# Altium project half-bridge-smps.PrjPcb
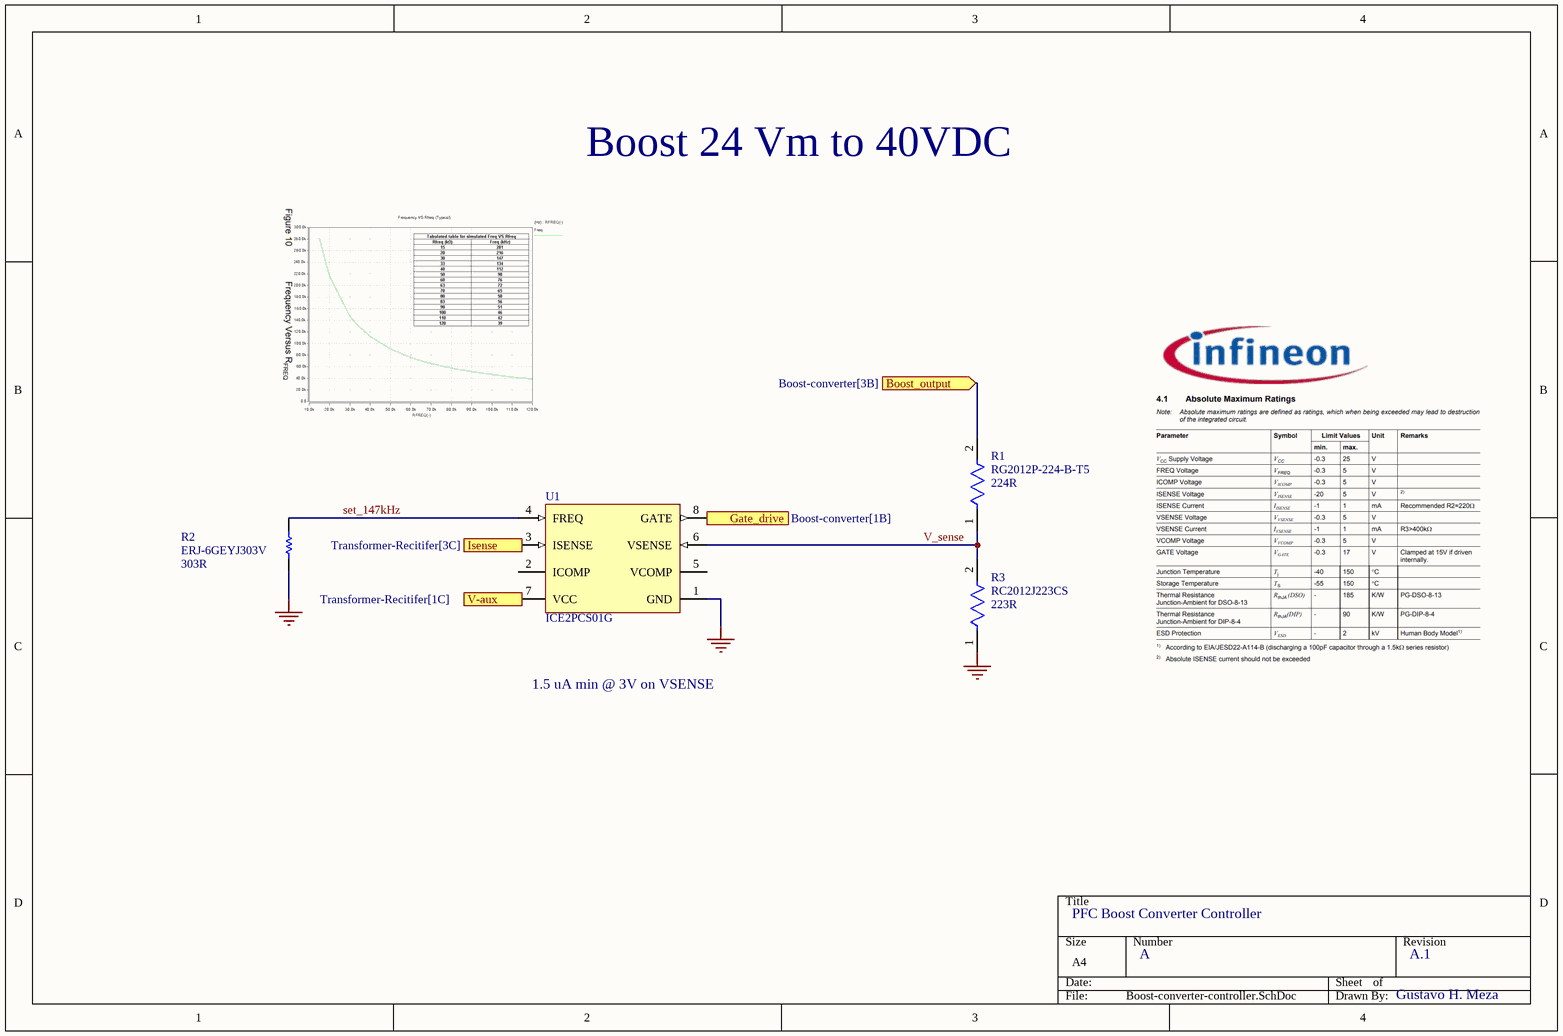
[diagram p0: Boost-converter-controller.SchDoc]
6 sheets, 44 parts. Net scope: flat (ports and power ports of the same name join across sheets).
Sheets:
  Boost-converter-controller.SchDoc
  Transformer-Recitifer.SchDoc
  Boost-converter.SchDoc
  Line-filter.SchDoc
  Buck-converter-controller.SchDoc
  Sheet1.SchDoc

## Sheet Boost-converter-controller.SchDoc
size A4; SheetNumber: 1; SheetTotal: 6

### Parts
R1  RG2012P-224-B-T5  Resistance: 224R  [FP-RG2012-IPC_A]
R2  ERJ-6GEYJ303V  Resistance: 303R  [RESC2013X70X40NL20T20]
R3  RC2012J223CS  Resistance: 223R  [FP-RC2012-IPC_A]
U1  ICE2PCS01G  [INF-PG-DSO-8-16_N]

### Ports
Boost_output (in, see Boost-converter[3B]), Gate_drive (out, see Boost-converter[1B]), Isense (in, see Transformer-Recitifer[3C]), V-aux (in, see Transformer-Recitifer[1C])

### Nets
GND: R2.1 R3.1 U1.1(GND)  [project net DTC]
set_147kHz: R2.2 U1.4(FREQ)
V_sense: R1.1 R3.2 U1.6(VSENSE)
NetC5_2: R1.2 ; port Boost_output
NetR7_1: U1.8(GATE) ; port Gate_drive

Not connected (* = marked no-connect by the designer): U1 2(ICOMP) 3(ISENSE) 5(VCOMP) 7(VCC)

### Notes on the sheet
- Boost 24 Vm to 40VDC
- 1.5 uA min @ 3V on VSENSE
- PFC Boost Converter Controller
- A
- A.1
- Gustavo H. Meza

### Library data of the parts
R1 = CMP-2001-02850-2: Automotive Metal Thin Film Chip Resistor, 0805, 220kΩ, 0.1%, 25ppm/°C, 0.125W, 150V; Voltage Rating: 100V; Power Rating: 100mW; Max Power Dissipation: 125mW; Voltage Rating (DC): 150V; Length: 0.079inch; RoHS Compliant: Yes; Series: RG; Termination: SMD/SMT; Case Code (Metric): 2012; Resistor Type: Thin Film; Lead Free: Lead Free; Number of Terminations: 2; Width: 0.049inch; Features: Automotive AEC-Q200; Case Code (Imperial): 0805; Packaging: Tape and Reel; Min Operating Temperature: -55°C; Max Operating Temperature: 155°C; Case/Package: 0805; Tolerance: 0.1%; Temperature Coefficient: 25ppm/°C; Package Quantity: 1; Height: 0.02inch
R2 = CMP-2001-00396-1: Manufacturer: Panasonic; Part Number: ERJ-6GEYJ303V
R3 = CMP-13261-000383-1: Res Thick Film 0805 22kΩ 5% 0.125W ±100ppm/°C Molded SMD T/R; Voltage Rating (DC): 150V; Max Power Dissipation: 125mW; Packaging: Tape and Reel; Height: 0.024inch; Case/Package: 0805; Tolerance: 5%; Contact Plating: Tin; Package Quantity: 1; Max Operating Temperature: 155°C; Length: 2mm; Military Standard: Not; Min Operating Temperature: -55°C; Temperature Coefficient: 100ppm/°C; Width: 0.049inch; Case Code (Metric): 2012; Depth: 1.25mm; Number of Terminations: 2; Case Code (Imperial): 0805; Radiation Hardening: No; Composition: Thick Film; Lead Free: Lead Free; Features: Moisture Resistant
U1 = CMP-1105-00012-1: Standalone Power Factor Correction (PFC) Controller in Continuous Conduction Mode (CCM), 11 to 26 V, -1.5 A / 2 A Iq, -40 to 125 degC, PG-DSO-8-16, Reel, Green; Manufacturer: Infineon; Output: MOSFET Gate Driver; IQ (max): -1.5Â A / 2 A; Green: TRUE; VCC (max): 26Â V; Group: DSO-8; ICC (max): 20Â mA; Iq (typ): 300Â uA; VCC (min): 11Â V; Frequency ( f ) Range: 50kHz - 250kHz; PackageDescription: 8-Pin Plastic (Green) Dual Small Outline Package, 4.9 x 3.9 mm Body, 1.27 mm Pitch; Mounting Technology: Surface Mount; PackageReference: PG-DSO-8-16; PackageVersion: Mar-07; ComponentLink3Description: Package Specification; ComponentLink3URL: http://www.infineon.com/dgdl/TLE7259-2GE_DS_rev12.pdf?folderId=db3a3043163797a6011666d32a0c0de1&fileId=db3a3043163797a6011666d4dbb80de2&location=en.Products.Automotive_ICs.Automotive_Transceivers.LIN_Transceivers.DATASHEET.TLE7259-2GE_DS_rev12.pdf; Halogen-free: TRUE; ComponentLink1URL: http://www.infineon.com/; ComponentLink1Description: Manufacturer URL; PartNumber: ICE2PCS01G; ComponentLink2URL: http://www.infineon.com/dgdl/ProductDatasheetICE2PCS01_v2_3+Mar+2010.pdf?folderId=db3a304412b407950112b4182a3d24f8&fileId=db3a304412b407950112b427caa43ccf; ComponentLink2Description: Datasheet; DatasheetVersion: Rev. 2.3

## Sheet Transformer-Recitifer.SchDoc
size A4; SheetNumber: 2; SheetTotal: 6
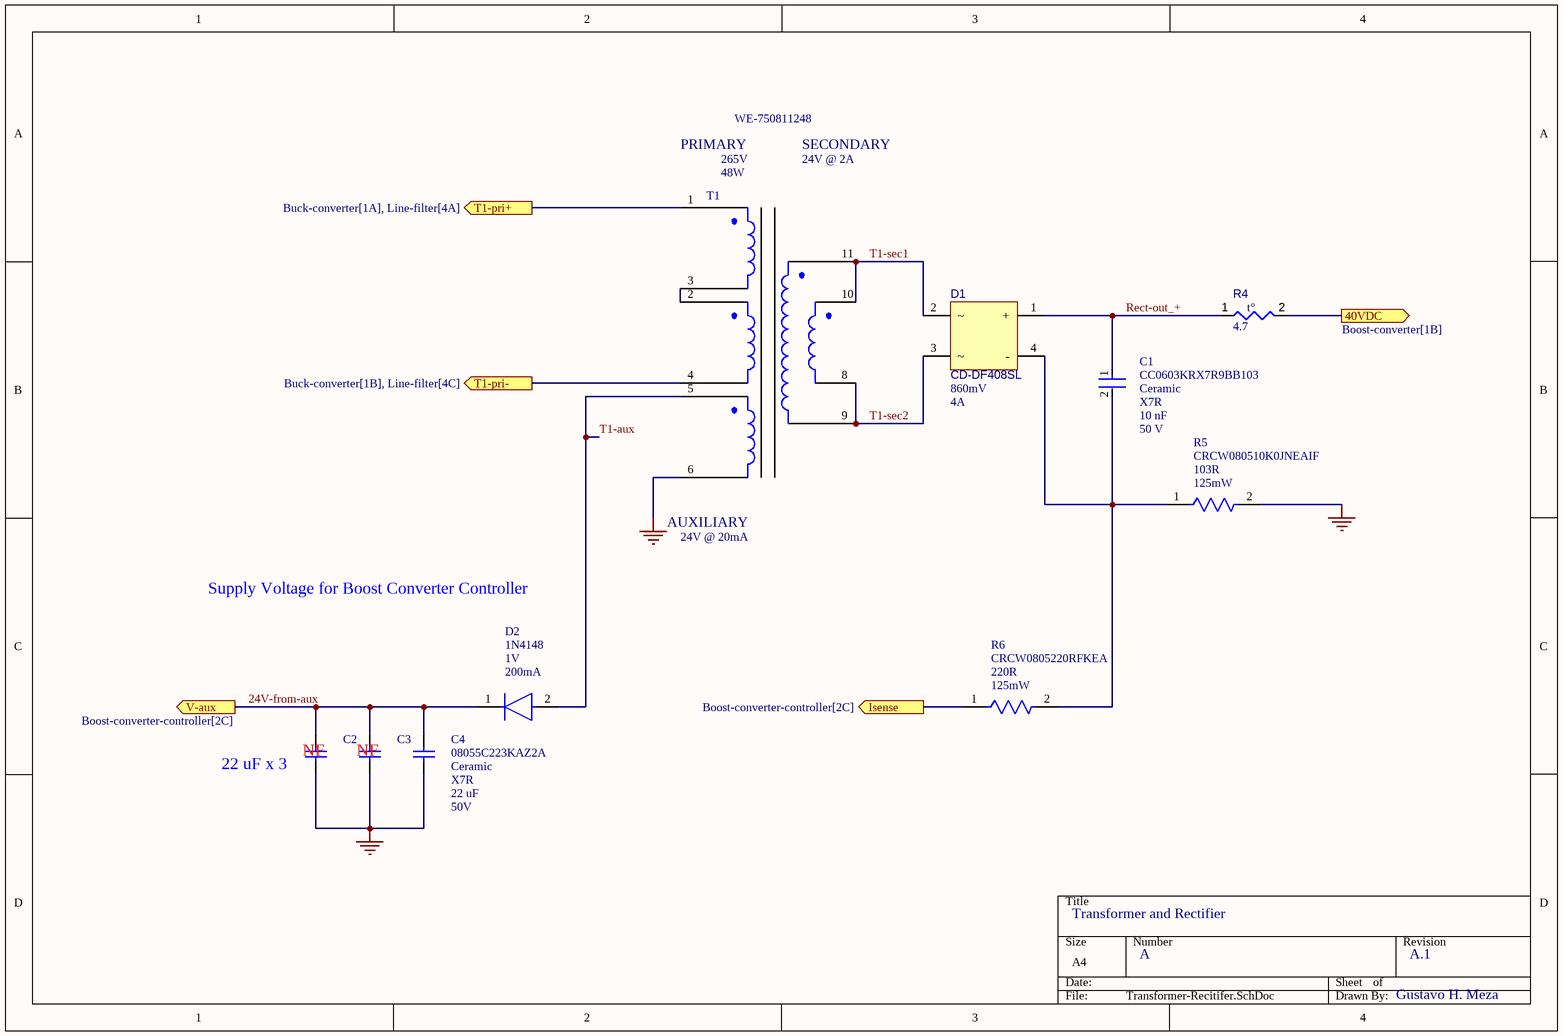
[diagram p1: Transformer-Recitifer.SchDoc]

### Parts
C1  CC0603KRX7R9BB103  Temperature Characteristic: X7R  Voltage Rating: 50 V  Material: Ceramic  Capacitance: 10 nF  [FP-CC0603-DA-MFG]
C2  08055C223KAZ2A  [CAPC2013X94X50ML20T25]  (value not drawn)
C3  08055C223KAZ2A  [CAPC2013X94X50ML20T25]  (value not drawn)
C4  08055C223KAZ2A  Capacitance: 22 uF  Voltage rating: 50V  Dieleectric: X7R  Material: Ceramic  [CAPC2013X94X50ML20T25]
D1  CD-DF408SL  Forward Voltage: 860mV  Forward Current: 4A  [CD-DF408SL-Footprint-1]
D2  1N4148  Forward Voltage: 1V  Output Current: 200mA  [FP-017AG-MFG]
R4  value 4.7  [B57236S0479M000-Footprint-1]  (hidden comment: B57236S0479M000)
R5  CRCW080510K0JNEAIF  Max Power Dissipation: 125mW  Resistance: 103R  [FP-CRCW0805-e3-MFG]
R6  CRCW0805220RFKEA  Max Power Dissipation: 125mW  Resistance: 220R  [FP-CRCW0805-e3-MFG]
T1  WE-750811248  Power: 48W  Voltage Rating: 265V  Auxiliary winding voltage: 24V @ 20mA  Secondary winding voltage: 24V @ 2A  [WE-750811248-Footprint-1]

### Ports
40VDC (out, see Boost-converter[1B]), Isense (out, see Boost-converter-controller[2C]), T1-pri+ (out, see Buck-converter[1A], Line-filter[4A]), T1-pri- (out, see Buck-converter[1B], Line-filter[4C]), V-aux (out, see Boost-converter-controller[2C])

### Nets
GND: C2.1 C3.1 C4.1 R5.2 T1.6  [project net DTC]
24V-from-aux: C2.2 C3.2 C4.2 D2.1(C) ; port V-aux
Rect-out_+: C1.1 D1.1(+) R4.1
T1-aux: D2.2(A) T1.5
T1-sec1: D1.2 T1.10 T1.11
T1-sec2: D1.3 T1.8 T1.9
NetC1_2: C1.2 D1.4(-) R5.1 R6.2
NetL1_1: R4.2 ; port 40VDC
NetL2_3: T1.4 ; port T1-pri-
NetL2_4: T1.1 ; port T1-pri+
NetR6_1: R6.1 ; port Isense
NetT1_2: T1.2 T1.3

### Notes on the sheet
- PRIMARY
- SECONDARY
- (near T1) AUXILIARY
- Supply Voltage for Boost Converter Controller
- (near C2) 22 uF x 3
- (near C2) NF
- (near C3) NF
- Transformer and Rectifier
- A
- A.1
- Gustavo H. Meza
- (in symbol CMP-009-00189-1) t°

### Library data of the parts
C1 = CMP-2100-03600-2: CAP CER 10000PF 50V X7R 0603; Manufacturer: YAGEO; Tolerance: 0.1; Temperature Coefficient: 15%; Value: 10 nF; Mouser Description: Multilayer Ceramic Capacitor, CC Series, 0.01 - F, - 10%, X7R, 50 V, 0603 [1608 Metric]; Digikey Description: CAP CER 10000PF 50V X7R 0603; Height: 0.9mm; Category: Cap; Footprint Url: http://www.yageo.com/exep/pages/download/literatures/UPY-C_GEN_24.pdf; Lead Free: Yes; Manufacturer Part Number: CC0603KRX7R9BB103; Temperature: -55°C to +125°C; Device Class L3: Ceramic Capacitors; ComponentLink2Description: Datasheet; Voltage: 50 V; Package: CC0603-DA; Octopart: https://octopart.com/cc0603krx7r9bb103-yageo-192938; Automotive: No; Temperature Range High: +125°C; Temperature Range Low: -55°C; RoHS: TRUE; Device Class L1: Passive Components; ComponentLink2URL: http://www.yageo.com/documents/recent/UPY-GPHC_X7R_6.3V-to-50V_18.pdf; Device Class L2: Capacitors
C2-C4 = CMP-2007-04398-1: Manufacturer: AVX Interconnect / Elco; Part Number: 08055C223KAZ2A
D1 = CMP-004-00034-1: Bridge Rectifier Diode, 1 Phase, 4A, 800V V(RRM), Silicon; Max Surge Current: 150A; Reach SVHC Compliant: No; Min Operating Temperature: -55°C; Max Operating Temperature: 175°C; RoHS Compliant: Yes; Mounting Technology: Flat; JESD-609 Code: e3; Diode Type: RECTIFIER
D2 = CMP-07163-000046-1: DIODE GEN PURP 100V 200MA DO35; Max Power Dissipation: 500mW; Max Reverse Current: 5uA; Forward Current: 300mA; Current: 4A; Reverse Recovery Time: 4ns; Element Configuration: Single; Outside Diameter: 1.85mm; Capacitance: 4pF; Polarity: Standard; Max Forward Surge Current (Ifsm): 1A; Reverse Voltage: 100V; Average Rectified Current: 200mA; Diameter: 1.91mm; Max Repetitive Reverse Voltage (Vrrm): 100V; Current Rating: 200mA; Case/Package: DO-35; Lead Free: Lead Free; Number of Pins: 2; Recovery Time: 4ns; Packaging: Bulk; Contact Plating: Tin; Voltage: 100V; Mount: Through Hole; Max Surge Current: 4A; Package Quantity: 2000; Width: 1.91mm; Max Reverse Voltage (DC): 100V; Length: 4.56mm; Radiation Hardening: No; Power Dissipation: 500mW; Voltage Rating (DC): 100V; Peak Non-Repetitive Surge Current: 4A; REACH SVHC: No SVHC; Height: 4.56mm; Max Operating Temperature: 175°C; Series: -; Weight: 0.01lb; Min Operating Temperature: -65°C
R4 = CMP-009-00189-1: NTC Thermistor, 4.7ohm, Through Hole Mount; Tolerance: 20%; Power: 2.1W; Mounting Technology: Through Hole; Max Operating Temperature: 170°C; Min Operating Temperature: -55°C; JESD-609 Code: e3; Manufacturer Series: B57236S0479M000; RoHS Compliant: Yes; Pins: 2
R5 = CMP-00030-42634559-1: CRCW080510K0JNEAIF Res Thick Film 0805 10K Ohm 5% 0.125W(1/8W) ±200ppm/°C Pad SMD Automotive T/R; Manufacturer Package Identifier: CRCW0805-e3; Voltage Rating: 150V; Depth: 1.25mm; Case Code (Metric): 2012; Case/Package: 0805; Military Standard: Not; NexarPartId: 42634559; Case Code (Imperial): 0805; Termination: Solder; Width: 1.2446mm; REACH SVHC: Unknown; Min Operating Temperature: -55°C; Length: 2mm; Packaging: Tape & Reel (TR); Lead Free: Lead Free; Number of Pins: 2; Power Rating: 125mW; Composition: Thick Film; RoHS: Compliant; Temperature Coefficient: 200ppm/°C; Features: Automotive AEC-Q200; Voltage Rating (DC): 150V; Height: 508µm; Tolerance: 5%; Schedule B: 8533210045, 8533210045; Max Operating Temperature: 155°C; Number of Terminations: 2
R6 = CMP-2001-03682-2: RES Thick Film, 220Ω, 1%, 0.125W, 100ppm/°C, 0805; Voltage Rating: 150V; Packaging: Tape and Reel; Termination: SMD/SMT; Height: 0.45mm; Package Quantity: 10; Width: 0.049inch; Min Operating Temperature: -55°C; Lead Free: Lead Free; Military Standard: Not; Mount: Surface Mount; Max Operating Temperature: 155°C; Voltage Rating (DC): 150V; Composition: Thick Film; Case/Package: 0805; Length: 2mm; Weight: 0.000194oz; Case Code (Metric): 2012; Number of Terminations: 2; Case Code (Imperial): 0805; Radiation Hardening: No; Tolerance: 1%; Features: Automotive AEC-Q200; Power Rating: 125mW; Depth: 1.25mm; Contact Plating: Tin; Temperature Coefficient: 100ppm/°C
T1 = CMP-012-00000-1: Power Transformers MID-L3798/99 Offline Isol 3.6uH +-10%; Inductance: 300uH; Turns Ratio: 0.167372; Min Operating Temperature: -40°C; Mounting Technology: THT; Max Operating Temperature: 125°C; Pins: 10; RoHS Compliant: Yes

## Sheet Boost-converter.SchDoc
size A4; SheetNumber: 3; SheetTotal: 6
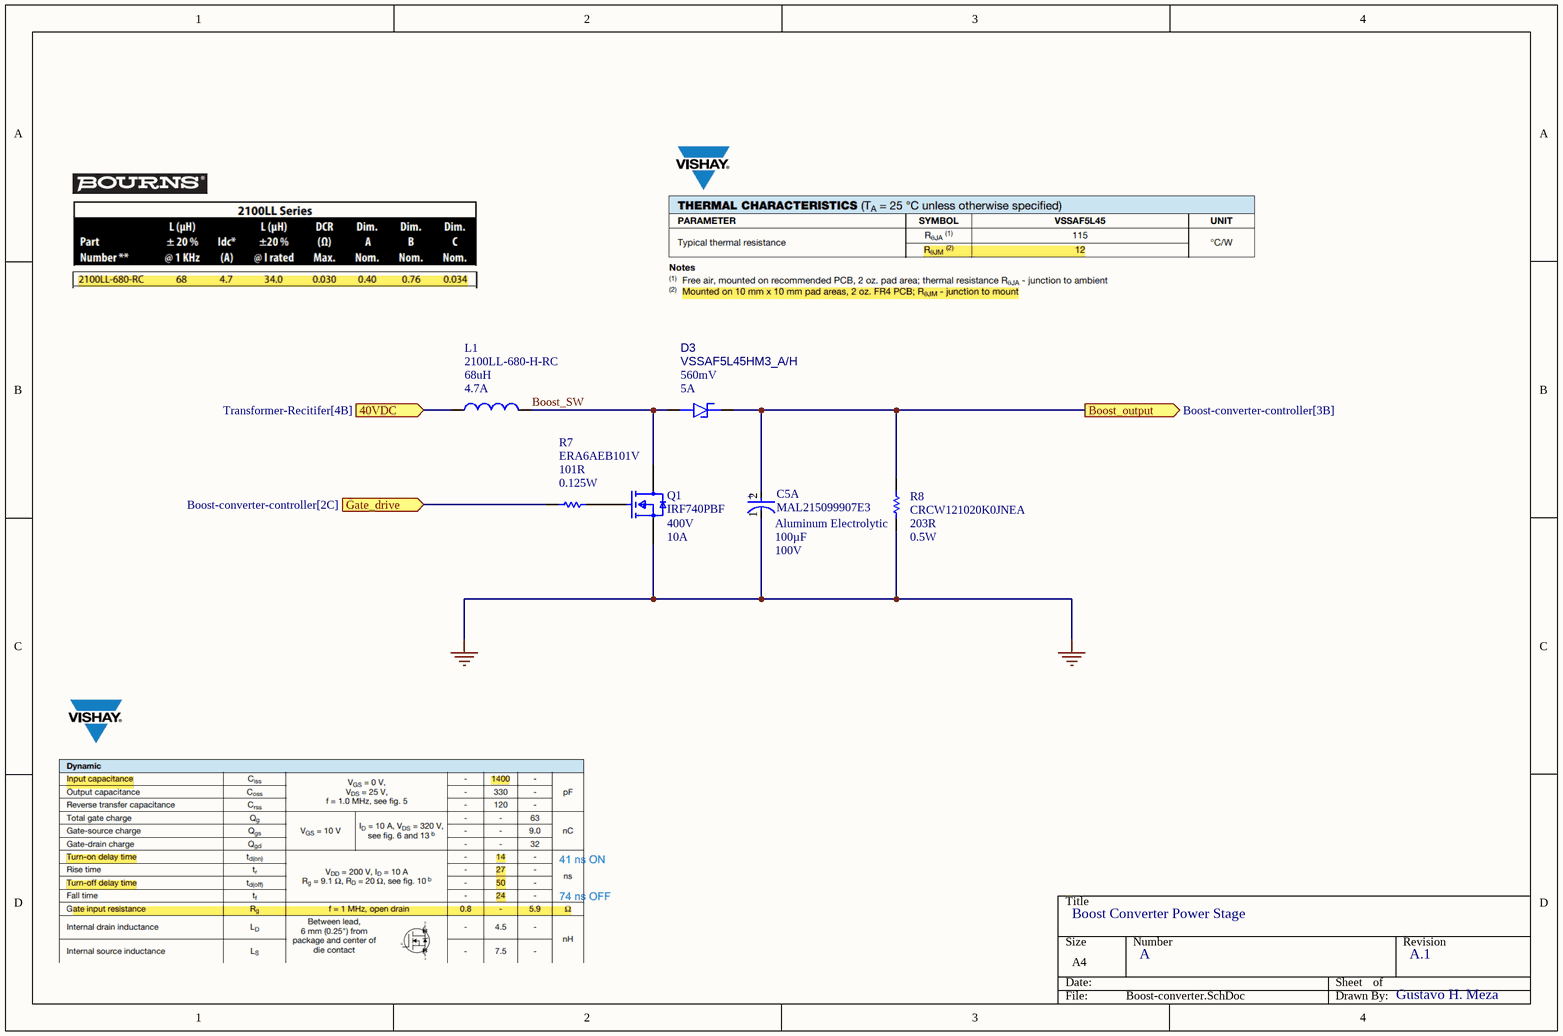
[diagram p2: Boost-converter.SchDoc]

### Parts
C5  MAL215099907E3  Voltage Rating: 100V  Capacitance: 100µF  Construction: Aluminum Electrolytic  [FP-MAL215099907E3-MFG]  (part A of 2)
D3  VSSAF5L45HM3_A/H  Forward Current: 5A  Forward Voltage: 560mV  [VSSAF5L45HM3_A_H-Footprint-1]
L1  2100LL-680-H-RC  Inductance-Nom (L): 68uH  Max Current Rating: 4.7A  [2100LL-680-H-RC-Footprint-1]
Q1  IRF740PBF  Drain To Source Voltage: 400V  Continuous Drain Current: 10A  [FP-X15-0364-MFG]
R7  ERA6AEB101V  Resistance: 101R  Power rating: 0.125W  [RESC2013X60X40ML20T25]
R8  CRCW121020K0JNEA  Resistance: 203R  Power: 0.5W  [RESC3225X60X45NL20T20]

### Ports
40VDC (in, see Transformer-Recitifer[4B]), Boost_output (out, see Boost-converter-controller[3B]), Gate_drive (in, see Boost-converter-controller[2C])

### Nets
GND: C5.1(C) Q1.3(S) R8.1  [project net DTC]
Boost_SW: D3.2(A) L1.2 Q1.2(D)
NetC5_2: C5.2(A) D3.1(K) R8.2 ; port Boost_output
NetL1_1: L1.1 ; port 40VDC
NetQ1_1: Q1.1(G) R7.2
NetR7_1: R7.1 ; port Gate_drive

### Notes on the sheet
- Boost Converter Power Stage
- A
- A.1
- Gustavo H. Meza
- (in symbol CMP-00030-68114016-1, part A) +

### Library data of the parts
C5 = CMP-00030-68114016-1: MAL215099907E3 Cap Aluminum 100uF 100V 20% (12.5 X 13mm) Cylindrical 660mA 5000 hr 105°C Blister T/R; Dissipation Factor: 10%; Polarity: Polar; Life (Hours): 3000hours; Leakage Current: 100µA; Impedance: 350mΩ; Packaging: Tape & Reel (TR); NexarPartId: 68114016; Case/Package: Radial; Mount: Surface Mount; Voltage Rating (DC): 100V; Height - Seated (Max): 13.97mm; Max Operating Temperature: 105°C; Height: 14mm; RoHS: Compliant; Tolerance: 20%; Ripple Current: 660mA; Min Operating Temperature: -40°C
D3 = CMP-004-00033-2: Diode Schottky 45V 5A DO221AC; Diode Element Material: SILICON; Diode Type: RECTIFIER; Application(s): EFFICIENCY; Min Operating Temperature: -40°C; Max Operating Temperature: 150°C; Pins: 2; RoHS Compliant: Yes
L1 = CMP-006-00025-1: General Purpose Inductor, 68uH, 15%, 1 Element; Inductor Application: HIGH CURRENT INDUCTOR; DC Resistance (DCR): 30mR; Construction: Horizontal Mounting; RoHS Compliant: Yes; Tolerance: 15%; Max Operating Temperature: 125°C; Pins: 2; Min Operating Temperature: -55°C
Q1 = CMP-02550-000088-1: MOSFET N-CH 400V 10A TO-220AB; Manufacturer: Vishay; Power Dissipation: 125W; Turn On Delay Time: 14ns; Standoff Height: 3.33mm; Max Junction Temp: +150°C; Number Of Channels: 1; Reverse Recovery Charge: 3800nC; Turn Off Delay Time: 50ns; Threshold Vgs Min: 2V; Input Capacitace At Vds: 1400pF @ 25V; Depletion Mode: False; Gate Charge At Vgs: 63nC @ 10V; Rthja Max: 62°C/W; Threshold Vgs Max: 4V; Gate To Source Voltage: 20V; Pulse Drain Current: 40A; Reverse Recovery Time: 370ns; Drain To Source Resistance: 0.55Ω; Temperature Range Low: -55°C; Mouser Description: MOSFET N-Chan 400V 10 Amp; Package: X15-0364; RoHS: TRUE; Manufacturer Part Number: IRF740PBF; Category: Trans; Drain To Source Breakdown Voltage: 400V; Device Class L3: MOSFETs; Lead Free: Yes; Height: 19.89mm; Octopart: https://octopart.com/irf740pbf-vishay-46527100; Automotive: No; Max Forward Diode Voltage: 2V; Device Class L1: Discrete Semiconductors; ComponentLink2URL: http://www.vishay.com/docs/91054/91054.pdf; Temperature Range High: +150°C; Device Class L2: Transistors; ComponentLink2Description: Datasheet; Temperature: -55°C to +150°C; Number Of N Channels: 1; Digikey Description: MOSFET N-CH 400V 10A TO-220AB
R7 = CMP-2001-00580-1: Manufacturer: Panasonic; Part Number: ERA6AEB101V
R8 = CMP-2005-02060-1: Manufacturer: Vishay Dale; Part Number: CRCW121020K0JNEA

## Sheet Line-filter.SchDoc
size A4; SheetNumber: 4; SheetTotal: 6
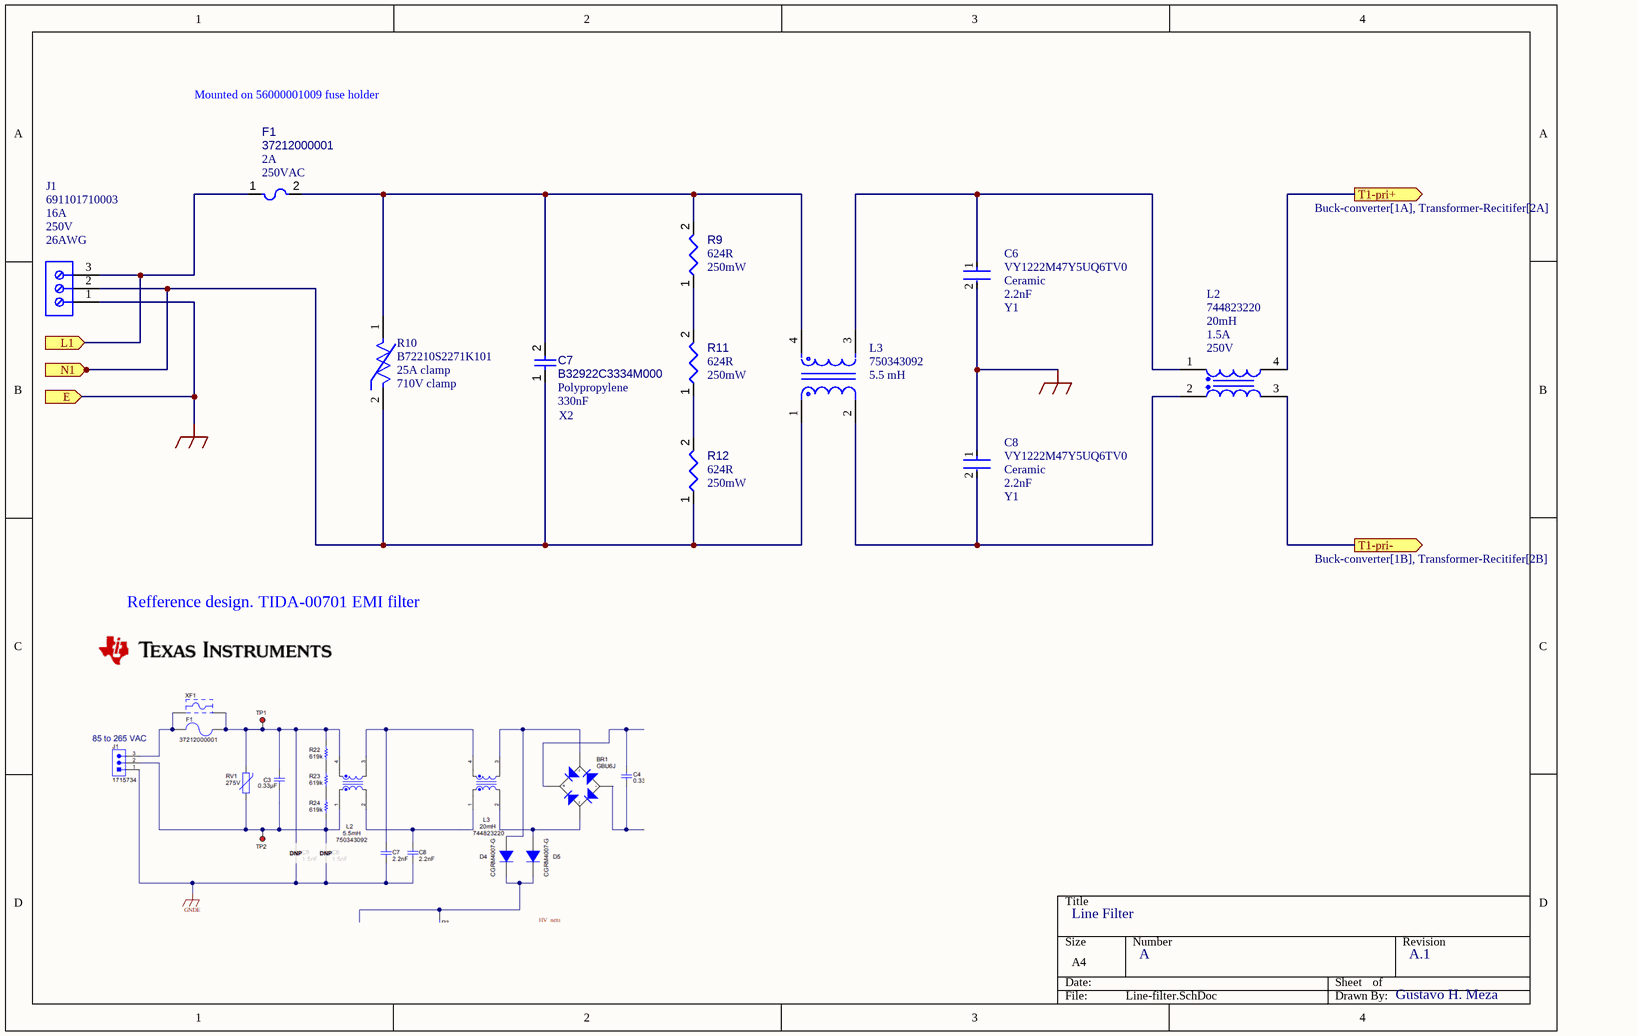
[diagram p3: Line-filter.SchDoc]

### Parts
C6  VY1222M47Y5UQ6TV0  Resistor Type: Ceramic  Capacitance: 2.2nF  Safety rating: Y1  [FP-VY1470-MFG]
C7  B32922C3334M000  value 330nF  Dielectric Material: Polypropylene  Safety rating: X2  [B32922C3334M000-Footprint-1]
C8  VY1222M47Y5UQ6TV0  Resistor Type: Ceramic  Capacitance: 2.2nF  Safety rating: Y1  [FP-VY1470-MFG]
F1  37212000001  Current Rating: 2A  Voltage rating: 250VAC  [37212000001-Footprint-1]
J1  691101710003  Voltage Rating: 250V  Current: 16A  Wire Gauge (Min): 26AWG  [691101710003]
L2  744823220  Voltage Rating: 250V  Current Rating: 1.5A  Inductance: 20mH  [WE-CMB_Type M_L23W13.8H25.5]
L3  750343092  Inductance: 5.5 mH  [FP-750343092-0]
R9  value 624R  Power: 250mW  [RESC3216X06N]  (hidden comment: CRCW1206619KFKEA)
R10  B72210S2271K101  Clamping Current: 25A clamp  Clamping Voltage: 710V clamp  [FP-B72210S2271K101-MFG]
R11  value 624R  Power: 250mW  [RESC3216X06N]  (hidden comment: CRCW1206619KFKEA)
R12  value 624R  Power: 250mW  [RESC3216X06N]  (hidden comment: CRCW1206619KFKEA)

### Ports
E (in), L1 (in), N1 (in), T1-pri+ (out, see Buck-converter[1A], Transformer-Recitifer[2A]), T1-pri- (out, see Buck-converter[1B], Transformer-Recitifer[2B])

### Nets
GND: C6.2 C8.1 J1.1 ; port E  [project net DTC]
NetC6_1: C6.1 L2.1 L3.3
NetC7_1: C7.1 J1.2 L3.1 R10.2 R12.1 ; port N1
NetC7_2: C7.2 F1.2 L3.4 R9.2 R10.1
NetC8_2: C8.2 L2.2 L3.2
NetF1_1: F1.1 J1.3 ; port L1
NetL2_3: L2.3 ; port T1-pri-
NetL2_4: L2.4 ; port T1-pri+
NetR9_1: R9.1 R11.2
NetR11_1: R11.1 R12.2

### Notes on the sheet
- Mounted on 56000001009 fuse holder
- Refference design. TIDA-00701 EMI filter
- Line Filter
- A
- A.1
- Gustavo H. Meza

### Library data of the parts
C6 C8 = CMP-02417-000069-1: CAP CER 2200PF 760VAC Y5U RADIAL; Lead Diameter: 0.6mm; Ratings: X1; Voltage Rating (AC): 500V; Lead/Base Style: Kinked; Tolerance: 20%; Max Operating Temperature: 125°C; Contact Plating: Tin; Thickness: 5mm; Width: 5mm; Min Operating Temperature: -40°C; Depth: 5mm; Mount: Through Hole; Termination: Radial; Lead Free: Lead Free; Diameter: 12mm; Height: 15mm; Radiation Hardening: No; Lead Pitch: 10mm; Case/Package: Radial; RoHS Compliant: Yes; Series: VY1; Dielectric: Y5U; Construction: RADIAL; Voltage: 500V; Voltage Rating (DC): 500V; Packaging: Tape and Reel; Height - Seated (Max): 0.63inch; Package Quantity: 500
C7 = CMP-001-00088-1: Film Capacitor, Polypropylene, 630V, 20% +Tol, 20% -Tol, 0.33uF, Through Hole Mount; Max Operating Temperature: 110°C; Min Operating Temperature: -40°C; RoHS Compliant: Yes; Pins: 2; Height: 8mm; Mounting Technology: Through Hole; Capacitor Type: FILM; Case/Package: 7155
F1 = CMP-005-00014-1: Electric Fuse, Time Lag Blow, 2A, 250VAC, 35A (IR), Through Hole, TR5; Body Height: 8mm; Body Length or Diameter: 8.5mm; Min Operating Temperature: -40°C; RoHS Compliant: Yes; Mounting Technology: Through Hole; Circuit Protection Type: Electric Fuse; Max Operating Temperature: 85°C
J1 = CMP-1502-03257-2: NexarPartId: 8917705; Pitch: 5.0038mm; Number of Positions Per Level: 3; Plating: Steel; Number of Levels: 1; Stripping Length: -7mm; REACH SVHC: Unknown; Width: 16.2mm; Height: 16.4mm; Contact Material: Brass; RoHS: Compliant; Color: Blue; Wire Gauge (Max): 26AWG; Contact Plating: Tin; Lead Pitch: 5mm; Packaging: Box; Termination: Screw; Number of Contacts: 3; Wire/Cable Gauge: 26AWG; Min Operating Temperature: -40°C; Max Operating Temperature: 105°C; Housing Material: Nylon; Length: 9mm; Voltage: 250V; Mount: Through Hole; Current Rating: 16A; Number of Pins: 3
L2 = CMP-0223-00090-2: NexarPartId: 22862925; Pin Length: 3mm; Resistance: 270mΩ; Inductance Tolerance: 30%; Max Operating Temperature: 125°C; Length: 23mm; Ambient Temperature Range Low: -40°C; Number of Pins: 4; Ambient Temperature Range High: 70°C; Height: 25.5mm; Min Operating Temperature: -40°C; Width: 13.8mm; RoHS: Compliant; Packaging: Bulk
L3 = CMP-207849-000003-1: Power Common Mode Choke; RoHS Compliant: No
R9 R11 R12 = CMP-009-00188-1: Fixed Resistor, Metal Glaze/thick Film, 0.25W, 619000ohm, 200V, 1% +/-Tol, 100ppm/Cel, Surface Mount, 1206; Additional Feature: RATED AC VOLTAGE (V): 200; JESD-609 Code: e3; Construction: Chip; Min Operating Temperature: -55°C; Mounting Technology: Surface Mount; Max Operating Temperature: 155°C; Tolerance: 1%; Case/Package: 1206; Pins: 2; RoHS Compliant: Yes
R10 = CMP-10618-000003-1: VARISTOR 430V 3.5KA DISC 10MM; Manufacturer: EPCOS; Value: 220pF; Voltage Rating Dc: 350V; Voltage Rating Ac: 275V; Voltage Tolerance: 10%; Temperature Range High: +105°C; RoHS: TRUE; Mouser Description: B722 Series 350 V 275 Vrms 710 V Clamp 3500 A 220 pF AdvanceD Leaded Varistor; ComponentLink2URL: https://www.tdk-electronics.tdk.com/inf/70/db/var/SIOV_Leaded_AdvanceD.pdf; Device Class L3: unset; Octopart: https://octopart.com/b72210s2271k101-epcos-42227876; Varistor Voltage: 430V; Category: Res; Package: 0; Temperature: -40°C to +105°C; ComponentLink2Description: Datasheet; Manufacturer Part Number: B72210S2271K101; Digikey Description: VARISTOR 430V 3.5KA DISC 10MM; Device Class L2: Varistors; Lead Free: Yes; Capacitance: 220pF; Device Class L1: Circuit Protection; Height: 14.5mm; Automotive: No; Temperature Range Low: -40°C

## Sheet Buck-converter-controller.SchDoc
size A4; SheetNumber: 6; SheetTotal: 6
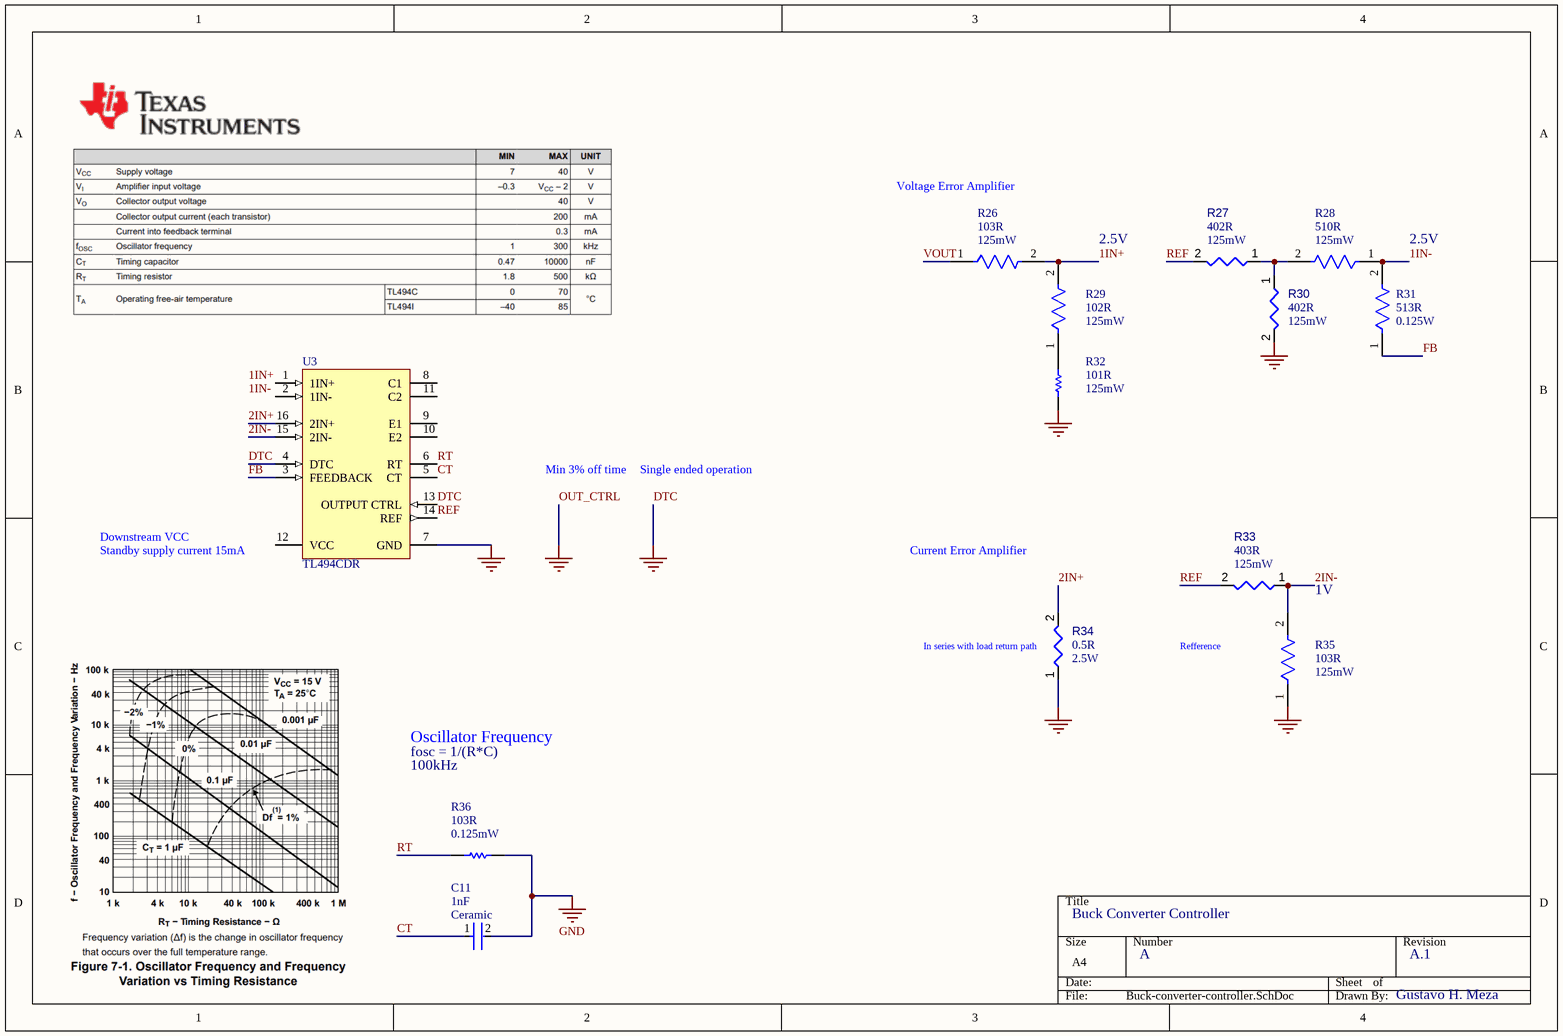
[diagram p4: Buck-converter-controller.SchDoc]

### Parts
C11  Capacitance: 1nF  Dielectric Material: Ceramic  [FP-0805-L_2_01_0_2-W_1_25-MFG]  (hidden comment: 08051A102JAT2A)
R26  Resistance: 103R  Power Rating: 125mW  [FP-CRCW0805-e3-IPC_A]  (hidden comment: CRCW080510K0FKEA)
R27  value 402R  Power: 125mW  [RESC3416X05N]  (hidden comment: CRCW08054K00FKTA)
R28  Resistance: 510R  Power Rating: 125mW  [FP-CR0805-IPC_B]  (hidden comment: CR0805JW511E)
R29  Power Rating: 125mW  Resistance: 102R  [FP-CRCW0805-e3-IPC_B]  (hidden comment: CRCW08051K00JNEA)
R30  value 402R  Power: 125mW  [RESC3416X05N]  (hidden comment: CRCW08054K00FKTA)
R31  value 513R  Power Rating: 0.125W  [FP-RT0805-MFG]  (hidden comment: RT0805BRD0751KL)
R32  Resistancemeter 1: 101R  Power: 125mW  [RESC2013X60X40ML20T25]  (hidden comment: ERA6AEB101V)
R33  value 403R  Power: 125mW  [RESC3416X05N]  (hidden comment: CRCW08054K00FKTA)
R34  value 0.5R  Power: 2.5W  [RS02CR5000FB12-Footprint-1]  (hidden comment: RS02CR5000FB12)
R35  Resistance: 103R  Max Power Dissipation: 125mW  [FP-ERA6A-IPC_C]  (hidden comment: ERA6AEB102V)
R36  Resistance: 103R  Power: 0.125mW  [RESC2013X60X35ML10T20]  (hidden comment: RC0805JR-0710KL)
U3  TL494CDR  [D0016A_N]

### Nets
DTC: C11.2 R30.2 R32.1 R34.1 R35.1 R36.2 U3.4(DTC) U3.7(GND) U3.13(OUTPUT_CTRL)  [also labelled GND, OUT_CTRL]
1IN+: R26.2 R29.2
1IN-: R28.1 R31.2
2IN+: R34.2 U3.16(2IN+)
2IN-: R33.1 R35.2 U3.15(2IN-)
CT: C11.1 U3.5(CT)
FB: R31.1 U3.3(FEEDBACK)
REF: R27.2 R33.2 U3.14(REF)
RT: R36.1 U3.6(RT)
VOUT: R26.1
NetR27_1: R27.1 R28.2 R30.1
NetR29_1: R29.1 R32.2

Not connected (* = marked no-connect by the designer): U3 1(1IN+) 2(1IN-) 8(C1) 9(E1) 10(E2) 11(C2) 12(VCC)

### Notes on the sheet
- Voltage Error Amplifier
- 2.5V
- Min 3% off time
- Single ended operation
- Downstream VCC
- (near U3) Standby supply current 15mA
- Current Error Amplifier
- (near R34) In series with load return path
- Refference
- 1V
- fosc = 1/(R*C)
- 100kHz
- Oscillator Frequency
- Buck Converter Controller
- A
- A.1
- Gustavo H. Meza
- Labels drawn without touching a wire or pin: 1IN+, 1IN-

### Library data of the parts
C11 = CMP-2007-04527-2: General Purpose Ceramic Capacitor, 0805, 1nF, 5%, C0G, 30ppm/°C, 100V; Insulation Resistance: 100GR; Dissipation Factor: 2.5%; Mount: Surface Mount; Package Quantity: 1; Voltage: 100V; Lead Free: Lead Free; Case/Package: 0805; Voltage Rating: 100V; Dielectric: C0G; Case Code (Metric): 2012; Case Code (Imperial): 0805; REACH SVHC: No SVHC; Number of Pins: 2; Length: 2.01mm; Temperature Coefficient: 30ppm/°C; Depth: 1.25mm; Radiation Hardening: No; RoHS Compliant: Yes; Packaging: Tape and Reel; Min Operating Temperature: -55°C; Contact Plating: Tin; Tolerance: 5%; Termination: SMD/SMT; Height: 0.94mm; Thickness: 0.037inch; Voltage Rating (DC): 100V; Max Operating Temperature: 125°C; Width: 1.25mm
R26 = CMP-2001-04908-2: RES Thick Film, 10kΩ, 1%, 0.125W, 100ppm/°C, 0805; Voltage Rating (DC): 150V; Weight: 0.000194oz; Package Quantity: 5000; Military Standard: Not; Max Operating Temperature: 155°C; Temperature Coefficient: 100ppm/°C; Contact Plating: Tin; Width: 1.25mm; Height: 0.45mm; Radiation Hardening: No; Tolerance: 1%; Min Operating Temperature: -55°C; Voltage Rating: 150V; Length: 2mm; Depth: 1.25mm; Termination: SMD/SMT; Packaging: Tape and Reel; Case/Package: 0805; Case Code (Metric): 2012; Lead Free: Lead Free; Case Code (Imperial): 0805; Composition: Thick Film
R27 R30 R33 = CMP-009-00184-1: RES SMD 4K OHM 1% 1/8W 0805; Manufacturer Series: CRCW; Min Operating Temperature: -55°C; Mounting Technology: Surface Mount; Case/Package: 0805; RoHS Compliant: No; Pins: 2; Tolerance: 1%; JESD-609 Code: e0; Max Operating Temperature: 155°C
R28 = CMP-07231-001106-1: Thick Film Chip Resistors 0805 510Ω 0.125W 5% 200ppm/°C; Voltage Rating: 150V; Case Code (Imperial): 0805; Case Code (Metric): 2012; Max Operating Temperature: 155°C; Packaging: Tape and Reel; Termination: SMD/SMT; Thickness: 508um; Min Operating Temperature: -55°C; Tolerance: 5%; Height: 0.5mm; Width: 1.25mm; Length: 2mm; Case/Package: 0805; Temperature Coefficient: 200ppm/°C; Package Quantity: 5000
R29 = CMP-2001-03597-2: RES Thick Film, 1kΩ, 5%, 0.125W, 200ppm/°C, 0805; Voltage Rating: 150V; Depth: 1.25mm; Features: Automotive AEC-Q200; Case/Package: 0805; Lead Free: Lead Free; Width: 1.25mm; Temperature Coefficient: 200ppm/°C; Height: 0.02inch; Length: 2mm; Case Code (Metric): 2012; Mount: Surface Mount; Military Standard: Not; Contact Plating: Tin; Min Operating Temperature: -55°C; Number of Pins: 2; Weight: 0.000194oz; Case Code (Imperial): 0805; Packaging: Tape and Reel; Voltage Rating (DC): 150V; Number of Terminations: 2; Composition: Thick Film; Radiation Hardening: No; Tolerance: 5%; Package Quantity: 1; Max Power Dissipation: 125mW; Max Operating Temperature: 155°C; Termination: SMD/SMT
R31 = CMP-03412-030464-1: RES SMD 51K OHM 0.1% 1/8W 0805; Manufacturer: Yageo; Tolerance: 0.0025; Temperature Coefficient: 25 ppm/°C; Voltage Rating: 150V; Device Class L1: Passive Components; Mouser Description: Thin Film Resistors - SMD 1/8W 51K ohm .1% 25ppm; Temperature: -55°C to +155°C; Series: RT; RoHS: TRUE; ComponentLink2Description: Datasheet; Ipc Land Pattern Name: RESC200125X50; Digikey Description: RES SMD 51K OHM 0.1% 1/8W 0805; Category: Res; Temperature Range Low: -55°C; Package: RT0805; Manufacturer Part Number: RT0805BRD0751KL; ComponentLink2URL: http://www.yageo.com/documents/recent/PYu-RT_1-to-0.01_RoHS_L_9.pdf; Device Class L3: Chip SMD Resistors; Height: 0.6mm; Octopart: https://octopart.com/rt0805brd0751kl-yageo-1414977; Resistance: 51k; Footprint Url: http://www.yageo.com/exep/pages/download/literatures/PYu-R_Mount_10.pdf; Composition: Thin Film; Device Class L2: Resistors; Lead Free: Yes; Temperature Range High: +155°C; Automotive: No
R32 = CMP-2001-00580-1: Manufacturer: Panasonic; Part Number: ERA6AEB101V
R34 = CMP-009-00190-1: Fixed Resistor, Wire Wound, 2.5W, 0.5ohm, 1% +/-Tol, 90ppm/Cel, Through Hole Mount; Manufacturer Series: RS; Additional Feature: PRECISION; RoHS Compliant: No; Max Operating Temperature: 250°C; JESD-609 Code: e0; Pins: 2; Tolerance: 1%; Min Operating Temperature: -65°C; Mounting Technology: Through Hole
R35 = CMP-2001-00581-2: RES 1K OHM 0.1% 1/8W 0805; Temperature Coefficient: 25ppm/°C; Working Voltage: 100V; Height: 0.5mm; Technology: THIN FILM; REACH SVHC: No SVHC; Packaging: Tape and Reel; Length: 2mm; Width: 1.25mm; Resistance Tolerance: 0.1%; Series: ERA-6A; Resistor Type: Thin Film; Number of Pins: 2; Case Code (Metric): 2012; Voltage Rating: 100V; Radiation Hardening: No; Construction: Rectangular; Mount: Surface Mount; Number of Terminations: 2; Case/Package: 0805; Min Operating Temperature: -55°C; Military Standard: Not; RoHS Compliant: Yes; Termination: SMD/SMT; Case Code (Imperial): 0805; Depth: 1.25mm; Power Rating: 125mW; Max Operating Temperature: 155°C; Contact Plating: Tin; Package Quantity: 5000; Tolerance: 0.1%
R36 = CMP-2000-05025-1: Chip Resistor, 10 KOhm, +/- 5%, 0.125 W, -55 to 155 degC, 0805 (2012 Metric), RoHS, Tape and Reel; Manufacturer: Yageo; Resistor Element Type: ThickFilm; Voltage Rating: 150V; Product Range: RCSeries; SVHC: ToBeAdvised; Resistor Case Style: 0805[2012Metric]; Temperature Coefficient: ±100ppm/degC; Power Rating: 250mW; Automotive Qualification Standard: -; Datasheet Version: REV. 2, 09/2004; Packaging: CutTape; Resistance Tolerance: ±5%; MSL: MSL1-Unlimited; Manufacturer URL: http://www.yageo.com/; Datasheet URL: http://www.yageo.ru/pdf/RC0805.pdf; Package Description: 2-Pin Surface Mounted Device, Body 2 x 1.25 mm; Package Reference: 805
U3 = CMP-0319-00950-2: Pulse-Width-Modulation Control Circuit with Voltage Control, 45 % Duty Cycle, 0 to +70 degC, 16-pin SOIC (D), Green (RoHS & no Sb/Br); Manufacturer: Texas Instruments; Regulated Outputs(#): 2; Frequency(Max)(kHz): 300; Topology: Boost, Buck, Flyback, Forward, Full-Bridge, Half-Bridge, Push-Pull; SubFamily: PWM Controller; Duty Cycle(Max)(%): 45; Rating: Military; PackageDescription: 16-Pin Plastic Small Outline Integrated Circuit, 9.9 x 3.9 mm, Pitch 1.27 mm Pitch; Mounting Technology: Surface Mount; PackageReference: D0016A; DatasheetVersion: SLVS074E; Control Method: Voltage; ComponentLink1Description: Datasheet; ComponentLink1URL: http://www.ti.com/general/docs/lit/getliterature.tsp?genericPartNumber=TL494&fileType=pdf; Code_JEDEC: MS-012AC; Eco-Plan: Green (RoHS & no Sb/Br); PackageVersion: revM, Jun-2011; PartNumber: TL494CDR

## Sheet Sheet1.SchDoc
size A4; SheetNumber: 6; SheetTotal: 6

## Nets that join several sheets
DTC: Boost-converter-controller (R2.1 R3.1 U1.1), Transformer-Recitifer (5 pins), Boost-converter (C5.1 Q1.3 R8.1), Line-filter (C6.2 C8.1 J1.1), Buck-converter-controller (9 pins)
NetC5_2: Boost-converter-controller (R1.2), Boost-converter (C5.2 D3.1 R8.2)
NetL1_1: Transformer-Recitifer (R4.2), Boost-converter (L1.1)
NetL2_3: Transformer-Recitifer (T1.4), Line-filter (L2.3)
NetL2_4: Transformer-Recitifer (T1.1), Line-filter (L2.4)
NetR7_1: Boost-converter-controller (U1.8), Boost-converter (R7.1)